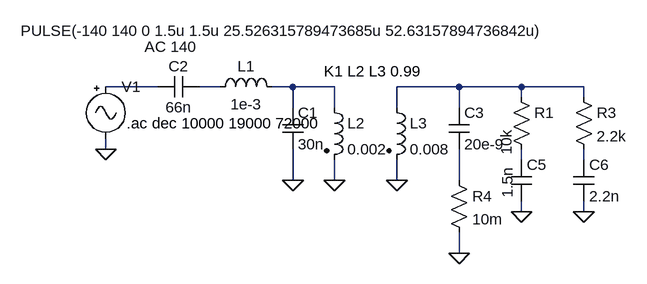
[diagram p0: schematic WaveUltrasonicOutputStage-v1.2.asc]
WaveUltrasonicOutputStage-v1.2.asc, the LTspice schematic file:
Version 4
SHEET 1 1488 516
WIRE 144 112 64 112
WIRE 240 112 208 112
WIRE 352 112 320 112
WIRE 416 112 352 112
WIRE 608 112 512 112
WIRE 704 112 608 112
WIRE 800 112 704 112
WIRE 704 128 704 112
WIRE 800 128 800 112
WIRE 352 144 352 112
WIRE 416 144 416 112
WIRE 512 144 512 112
WIRE 608 144 608 112
WIRE 64 208 64 192
WIRE 704 224 704 208
WIRE 800 224 800 208
WIRE 352 256 352 208
WIRE 416 256 416 224
WIRE 512 256 512 224
WIRE 608 256 608 208
WIRE 704 304 704 288
WIRE 800 304 800 288
WIRE 608 368 608 336
FLAG 64 208 0
FLAG 416 256 0
FLAG 512 256 0
FLAG 608 368 0
FLAG 352 256 0
FLAG 704 304 0
FLAG 800 304 0
SYMBOL Misc\\signal 64 96 R0
WINDOW 123 60 -46 Left 2
WINDOW 39 0 0 Left 0
WINDOW 3 -131 -70 Left 2
SYMATTR Value2 AC 140
SYMATTR Value PULSE(-140 140 0 1.5u 1.5u 25.526315789473685u 52.63157894736842u)
SYMATTR InstName V1
SYMBOL ind2 400 128 R0
SYMATTR InstName L2
SYMATTR Value 0.002
SYMATTR Type ind
SYMBOL ind2 496 128 R0
SYMATTR InstName L3
SYMATTR Value 0.008
SYMATTR Type ind
SYMBOL ind 224 128 R270
WINDOW 0 32 56 VTop 2
WINDOW 3 5 56 VBottom 2
SYMATTR InstName L1
SYMATTR Value 1e-3
SYMBOL cap 336 144 R0
SYMATTR InstName C1
SYMATTR Value 30n
SYMBOL cap 208 96 R90
WINDOW 0 0 32 VBottom 2
WINDOW 3 32 32 VTop 2
SYMATTR InstName C2
SYMATTR Value 66n
SYMBOL res 688 112 R0
WINDOW 3 -7 105 VLeft 2
SYMATTR Value 10k
SYMATTR InstName R1
SYMBOL cap 688 224 R0
WINDOW 3 -6 12 VRight 2
SYMATTR Value 1.5n
SYMATTR InstName C5
SYMBOL res 784 112 R0
SYMATTR InstName R3
SYMATTR Value 2.2k
SYMBOL cap 784 224 R0
SYMATTR InstName C6
SYMATTR Value 2.2n
SYMBOL res 592 240 R0
SYMATTR InstName R4
SYMATTR Value 10m
SYMBOL cap 592 144 R0
SYMATTR InstName C3
SYMATTR Value 20e-9
TEXT 96 168 Left 2 !.ac dec 10000 19000 72000
TEXT 400 88 Left 2 !K1 L2 L3 0.99

The netlist it stands for:
* WaveUltrasonicOutputStage-v1.2.asc
V1 N001 0 PULSE(-140 140 0 1.5u 1.5u 25.526315789473685u 52.63157894736842u) AC 140
L2 N003 0 0.002
L3 N004 0 0.008
L1 N002 N003 1e-3
C1 N003 0 30n
C2 N002 N001 66n
R1 N004 N005 10k
C5 N005 0 1.5n
R3 N004 N006 2.2k
C6 N006 0 2.2n
R4 N007 0 10m
C3 N004 N007 20e-9
.ac dec 10000 19000 72000
K1 L2 L3 0.99
.backanno
.end